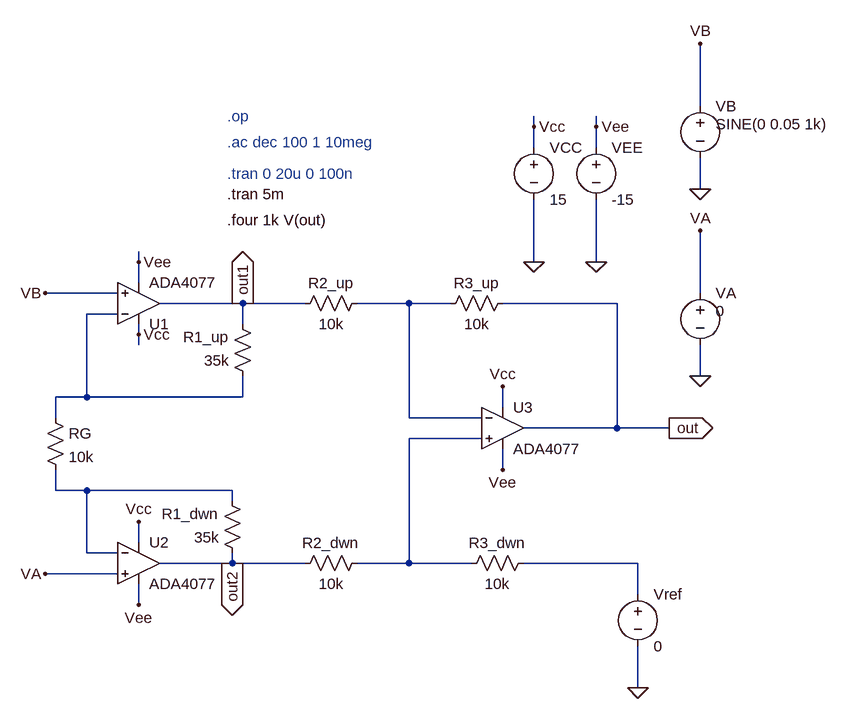
[diagram p0: schematic amp_inst_etaj1.asc]
amp_inst_etaj1.asc, the LTspice schematic file:
Version 4.1
SHEET 1 1464 680
WIRE 896 -864 896 -960
WIRE 640 -832 640 -848
WIRE 736 -832 736 -848
WIRE 640 -800 640 -832
WIRE 736 -800 736 -832
WIRE 896 -736 896 -784
WIRE 32 -624 32 -640
WIRE 640 -624 640 -720
WIRE 736 -624 736 -720
WIRE 32 -592 32 -624
WIRE 0 -576 -112 -576
WIRE 896 -576 896 -672
WIRE 192 -560 64 -560
WIRE 288 -560 192 -560
WIRE 448 -560 368 -560
WIRE 512 -560 448 -560
WIRE 768 -560 592 -560
WIRE 0 -544 -48 -544
WIRE 192 -528 192 -560
WIRE 32 -512 32 -528
WIRE 32 -496 32 -512
WIRE 896 -448 896 -496
WIRE -48 -416 -48 -544
WIRE -48 -416 -96 -416
WIRE 192 -416 192 -448
WIRE 192 -416 -48 -416
WIRE 592 -400 592 -432
WIRE -96 -384 -96 -416
WIRE 448 -384 448 -560
WIRE 560 -384 448 -384
WIRE 768 -368 768 -560
WIRE 768 -368 624 -368
WIRE 848 -368 768 -368
WIRE 560 -352 448 -352
WIRE 592 -304 592 -336
WIRE -96 -272 -96 -304
WIRE -48 -272 -96 -272
WIRE 176 -272 -48 -272
WIRE 176 -256 176 -272
WIRE 32 -192 32 -224
WIRE -48 -176 -48 -272
WIRE 0 -176 -48 -176
WIRE 176 -160 176 -176
WIRE 176 -160 64 -160
WIRE 288 -160 176 -160
WIRE 448 -160 448 -352
WIRE 448 -160 368 -160
WIRE 544 -160 448 -160
WIRE 800 -160 624 -160
WIRE 0 -144 -112 -144
WIRE 800 -112 800 -160
WIRE 32 -96 32 -128
WIRE 800 32 800 -32
FLAG 896 -448 0
FLAG 896 -736 0
FLAG -112 -144 VA
FLAG -112 -576 VB
FLAG 640 -624 0
FLAG 736 -624 0
FLAG 640 -832 Vcc
FLAG 736 -832 Vee
FLAG 32 -96 Vee
FLAG 32 -624 Vee
FLAG 32 -512 Vcc
FLAG 32 -224 Vcc
FLAG 800 32 0
FLAG 192 -560 out1
IOPIN 192 -560 Out
FLAG 176 -160 out2
IOPIN 176 -160 Out
FLAG 848 -368 out
IOPIN 848 -368 Out
FLAG 592 -432 Vcc
FLAG 592 -304 Vee
FLAG 896 -960 VB
FLAG 896 -672 VA
SYMBOL OpAmps\\ADA4077 32 -496 M180
SYMATTR InstName U1
SYMBOL OpAmps\\ADA4077 32 -224 R0
SYMATTR InstName U2
SYMBOL OpAmps\\ADA4077 592 -432 R0
SYMATTR InstName U3
SYMBOL res 208 -432 R180
WINDOW 0 36 76 Left 2
WINDOW 3 36 40 Left 2
SYMATTR InstName R1_up
SYMATTR Value 35k
SYMBOL res 192 -160 R180
WINDOW 0 36 76 Left 2
WINDOW 3 36 40 Left 2
SYMATTR InstName R1_dwn
SYMATTR Value 35k
SYMBOL res -112 -400 R0
SYMATTR InstName RG
SYMATTR Value 10k
SYMBOL voltage 896 -880 R0
WINDOW 3 24 44 Left 2
WINDOW 123 24 72 Left 2
WINDOW 39 0 0 Left 0
SYMATTR Value SINE(0 0.05 1k)
SYMATTR InstName VB
SYMBOL voltage 896 -592 R0
WINDOW 3 24 44 Left 2
WINDOW 123 24 72 Left 2
WINDOW 39 0 0 Left 0
SYMATTR Value 0
SYMATTR InstName VA
SYMBOL voltage 640 -816 R0
WINDOW 123 24 44 Left 2
WINDOW 39 0 0 Left 0
SYMATTR InstName VCC
SYMATTR Value 15
SYMBOL voltage 736 -816 R0
WINDOW 123 24 44 Left 2
WINDOW 39 0 0 Left 0
SYMATTR InstName VEE
SYMATTR Value -15
SYMBOL res 384 -576 R90
WINDOW 0 0 56 VBottom 2
WINDOW 3 32 56 VTop 2
SYMATTR InstName R2_up
SYMATTR Value 10k
SYMBOL res 384 -176 R90
WINDOW 0 0 56 VBottom 2
WINDOW 3 32 56 VTop 2
SYMATTR InstName R2_dwn
SYMATTR Value 10k
SYMBOL res 608 -576 R90
WINDOW 0 0 56 VBottom 2
WINDOW 3 32 56 VTop 2
SYMATTR InstName R3_up
SYMATTR Value 10k
SYMBOL res 640 -176 R90
WINDOW 0 0 56 VBottom 2
WINDOW 3 32 56 VTop 2
SYMATTR InstName R3_dwn
SYMATTR Value 10k
SYMBOL voltage 800 -128 R0
SYMATTR InstName Vref
SYMATTR Value 0
TEXT 168 -760 Left 2 ;.tran 0 20u 0 100n
TEXT 168 -808 Left 2 ;.ac dec 100 1 10meg
TEXT 168 -848 Left 2 ;.op
TEXT 168 -728 Left 2 !.tran 5m
TEXT 168 -688 Left 2 !.four 1k V(out)

The netlist it stands for:
* amp_inst_etaj1.asc
X§U1 VB N002 Vcc Vee out1 ADA4077  ; pins In+ In- V+ V- OUT
X§U2 VA N004 Vcc Vee out2 ADA4077  ; pins In+ In- V+ V- OUT
X§U3 N003 N001 Vcc Vee out ADA4077  ; pins In+ In- V+ V- OUT
R1_up N002 out1 35k
R1_dwn out2 N004 35k
RG N002 N004 10k
VB VB 0 SINE(0 0.05 1k)
VA VA 0 0
VCC Vcc 0 15
VEE Vee 0 -15
R2_up N001 out1 10k
R2_dwn N003 out2 10k
R3_up out N001 10k
R3_dwn N005 N003 10k
Vref N005 0 0
* .tran 0 20u 0 100n
* .ac dec 100 1 10meg
* .op
.tran 5m
.four 1k V(out)
.backanno
.end